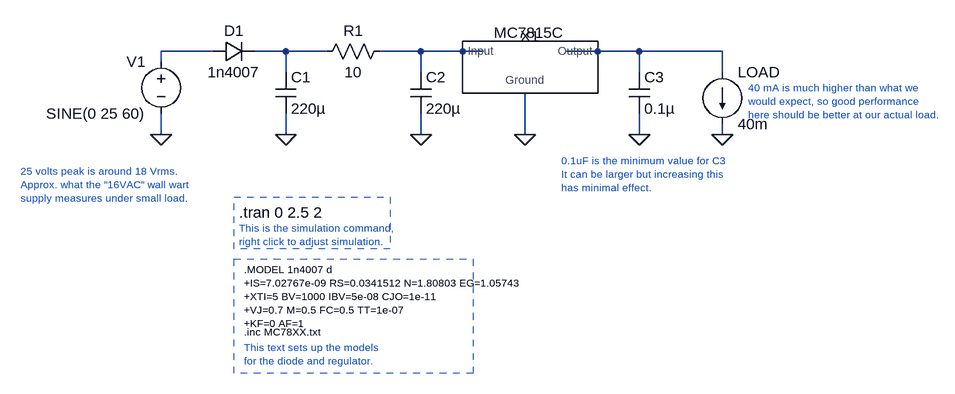
[diagram p0: schematic Power supply.asc]
Power supply.asc, the LTspice schematic file:
Version 4
SHEET 1 1564 2944
WIRE 240 16 160 16
WIRE 352 16 304 16
WIRE 416 16 352 16
WIRE 560 16 496 16
WIRE 656 16 560 16
WIRE 896 16 784 16
WIRE 1024 16 896 16
WIRE 160 32 160 16
WIRE 352 48 352 16
WIRE 560 48 560 16
WIRE 896 48 896 16
WIRE 1024 48 1024 16
WIRE 160 144 160 112
WIRE 352 144 352 112
WIRE 560 144 560 112
WIRE 720 144 720 80
WIRE 896 144 896 112
WIRE 1024 144 1024 128
FLAG 720 144 0
FLAG 160 144 0
FLAG 352 144 0
FLAG 896 144 0
FLAG 1024 144 0
FLAG 560 144 0
SYMBOL diode 240 32 R270
WINDOW 0 32 32 VTop 2
WINDOW 3 0 32 VBottom 2
SYMATTR InstName D1
SYMATTR Value 1n4007
SYMBOL voltage 160 16 M0
WINDOW 123 0 0 Left 2
WINDOW 39 0 0 Left 2
SYMATTR InstName V1
SYMATTR Value SINE(0 25 60)
SYMBOL cap 336 48 R0
SYMATTR InstName C1
SYMATTR Value 220µ
SYMBOL cap 880 48 R0
SYMATTR InstName C3
SYMATTR Value 0.1µ
SYMBOL current 1024 48 R0
WINDOW 123 0 0 Left 2
WINDOW 39 0 0 Left 2
SYMATTR InstName LOAD
SYMATTR Value 40m
SYMBOL MC78XX 720 48 R0
WINDOW 3 -48 -61 Left 2
SYMATTR Value MC7815C
SYMATTR InstName X1
SYMATTR Prefix X
SYMBOL res 512 0 R90
WINDOW 0 0 56 VBottom 2
WINDOW 3 32 56 VTop 2
SYMATTR InstName R1
SYMATTR Value 10
SYMBOL cap 544 48 R0
SYMATTR InstName C2
SYMATTR Value 220µ
TEXT 280 264 Left 2 !.tran 0 2.5 2
TEXT 288 352 Left 1 !.MODEL 1n4007 d\n+IS=7.02767e-09 RS=0.0341512 N=1.80803 EG=1.05743\n+XTI=5 BV=1000 IBV=5e-08 CJO=1e-11\n+VJ=0.7 M=0.5 FC=0.5 TT=1e-07\n+KF=0 AF=1
TEXT 288 448 Left 1 !.inc MC78XX.txt
TEXT -56 200 Left 1 ;25 volts peak is around 18 Vrms. \nApprox. what the "16VAC" wall wart \nsupply measures under small load.
TEXT 776 184 Left 1 ;0.1uF is the minimum value for C3\nIt can be larger but increasing this \nhas minimal effect.
TEXT 1064 72 Left 1 ;40 mA is much higher than what we \nwould expect, so good performance \nhere should be better at our actual load.
TEXT 288 472 Left 1 ;This text sets up the models \nfor the diode and regulator.
TEXT 280 288 Left 1 ;This is the simulation command, \nright click to adjust simulation.
RECTANGLE Normal 640 512 272 336 2
RECTANGLE Normal 512 320 272 240 2

The netlist it stands for:
* Power supply.asc
D1 N001 N002 1n4007
V1 N001 0 SINE(0 25 60)
C1 N002 0 220µ
C3 N004 0 0.1µ
I§LOAD N004 0 40m
XX1 N003 N004 0 MC7815C  ; pins Input Output Ground
R1 N003 N002 10
C2 N003 0 220µ
.model D D
.lib standard.dio
.tran 0 2.5 2
.MODEL 1n4007 d
+IS=7.02767e-09 RS=0.0341512 N=1.80803 EG=1.05743
+XTI=5 BV=1000 IBV=5e-08 CJO=1e-11
+VJ=0.7 M=0.5 FC=0.5 TT=1e-07
+KF=0 AF=1
.inc MC78XX.txt
* 25 volts peak is around 18 Vrms.
* Approx. what the "16VAC" wall wart
* supply measures under small load.
* 0.1uF is the minimum value for C3
* It can be larger but increasing this
* has minimal effect.
* 40 mA is much higher than what we
* would expect, so good performance
* here should be better at our actual load.
* This text sets up the models
* for the diode and regulator.
* This is the simulation command,
* right click to adjust simulation.
.lib C:\Users\boxca\external\Google Drive\Projects\zinc-box\LTSpice\microsim.lib
.backanno
.end